# Altium schematic sheet Sheet5.SchDoc: RS485, Relay & Connector
size 420 x 297 mm; SheetNumber: 5; SheetTotal: 5
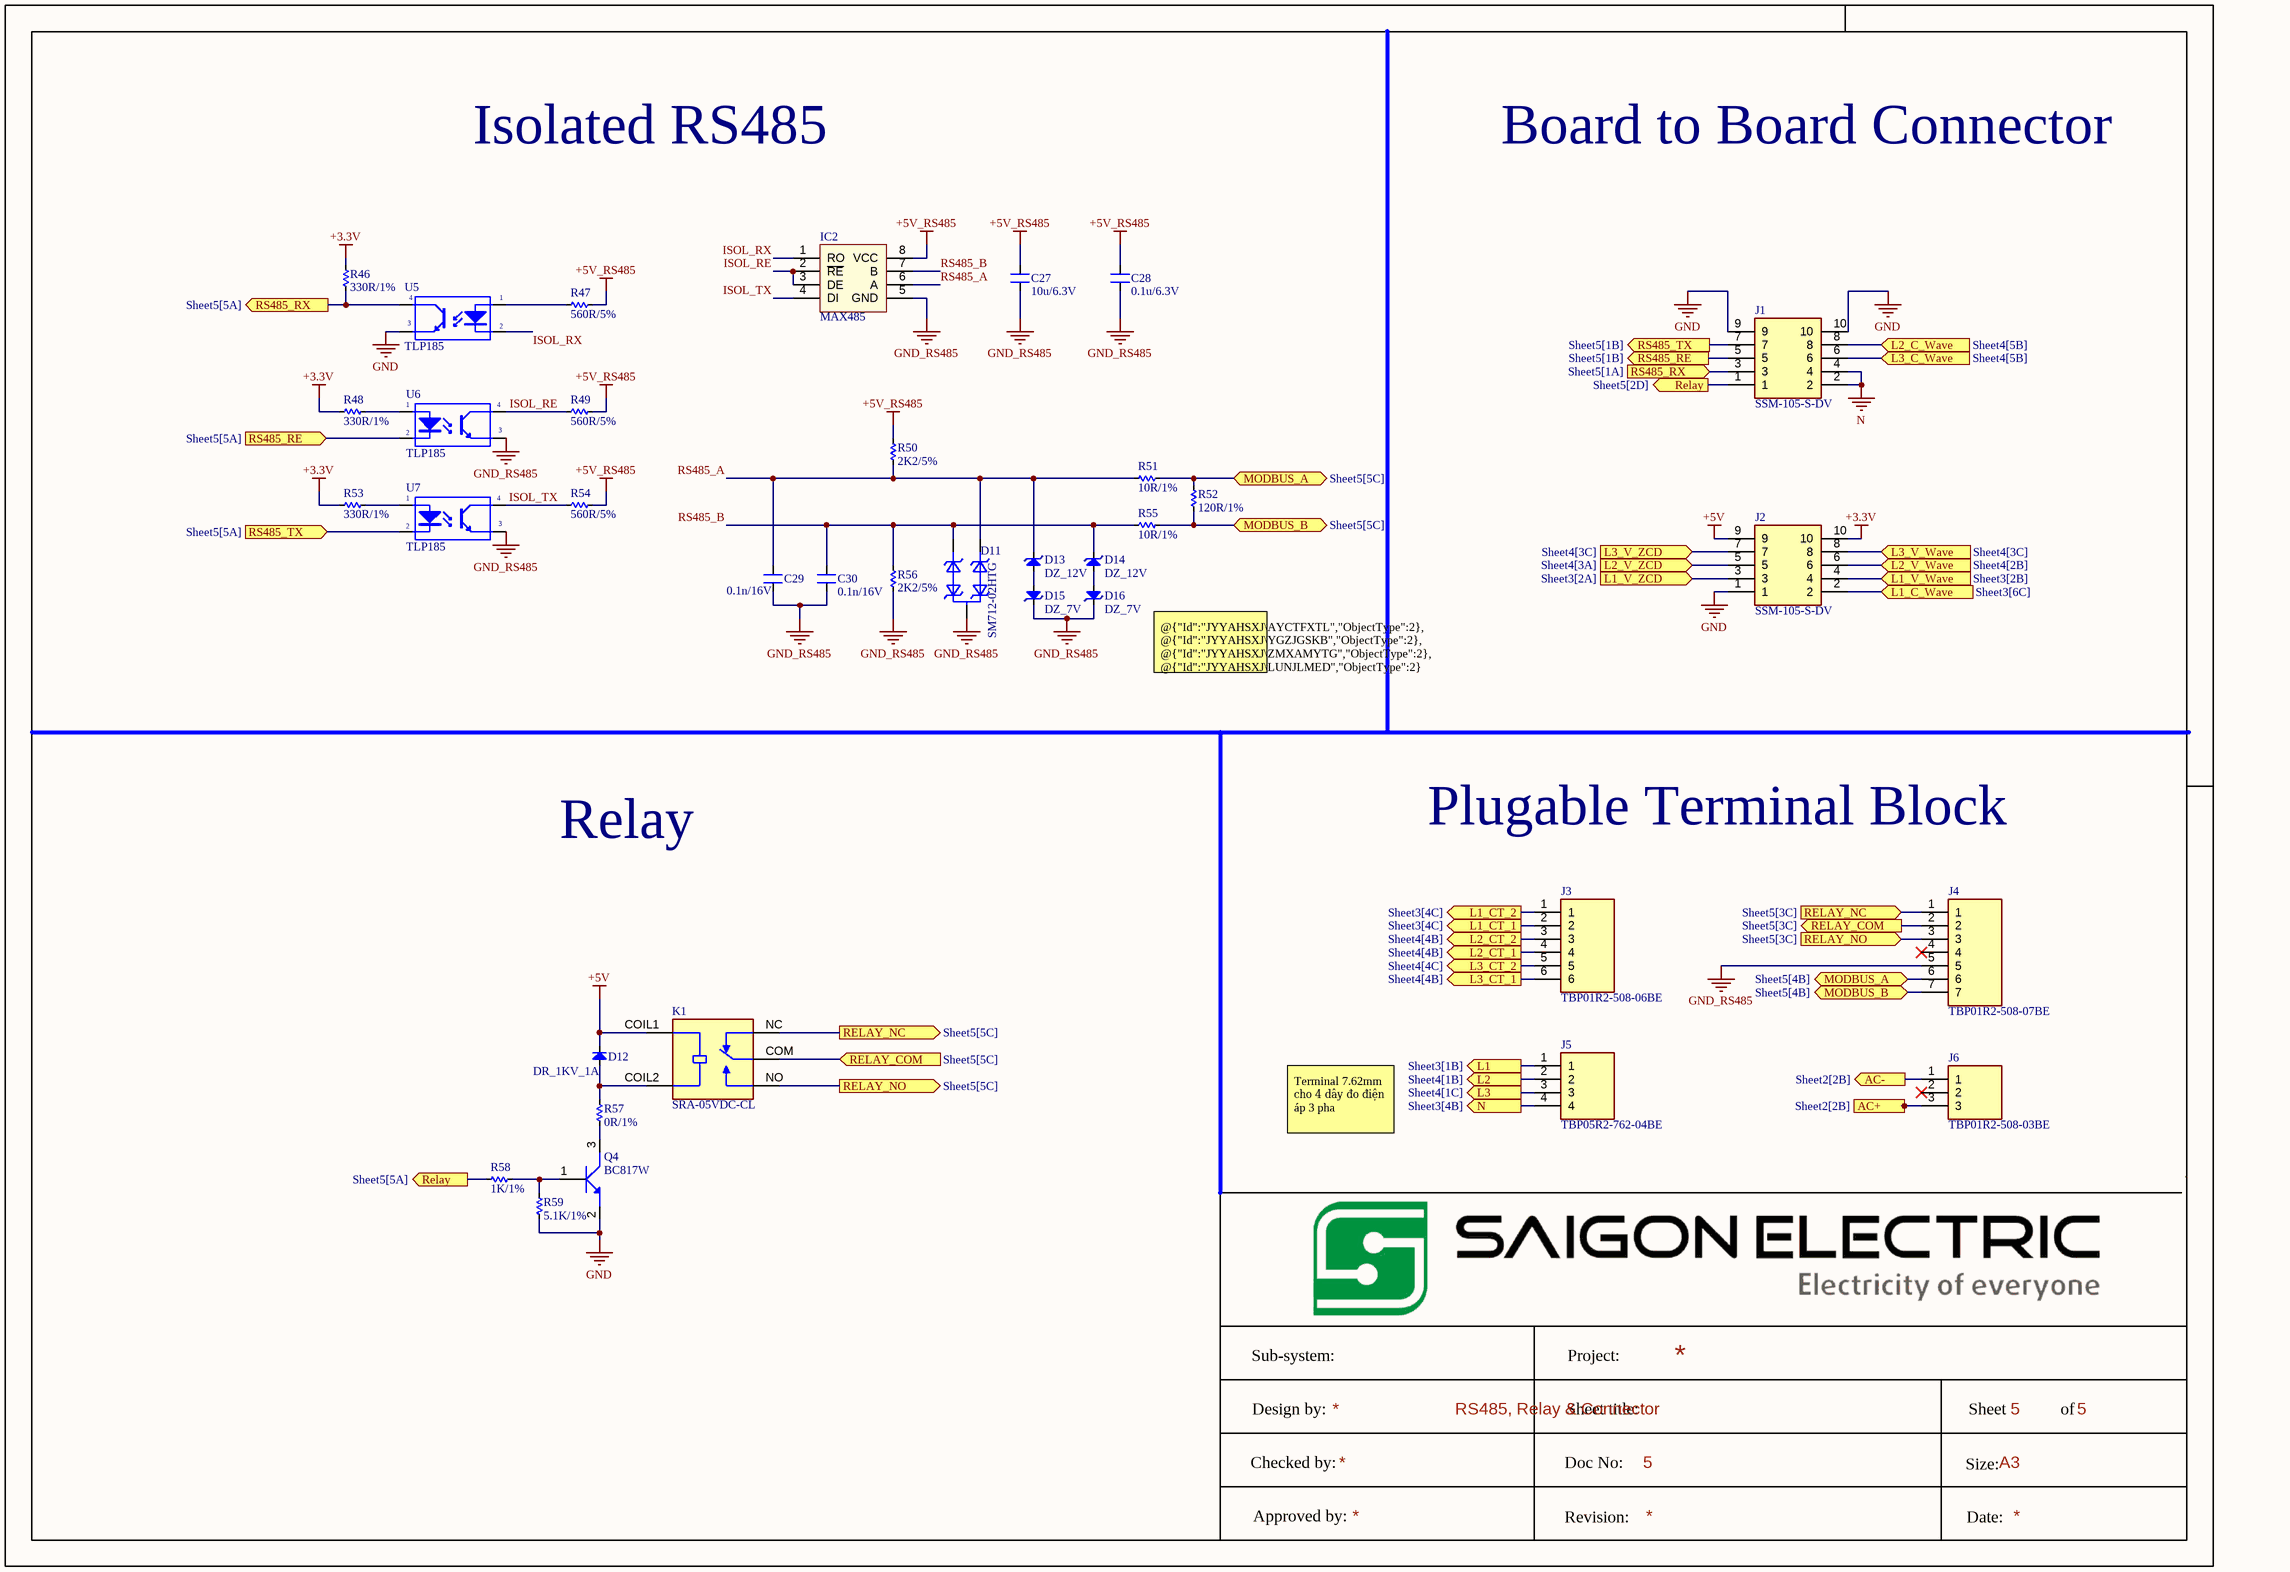
[diagram p0: Sheet5.SchDoc]

## Parts
C27  10u/6.3V  [CAP_C_2012X110]
C28  0.1u/6.3V  [CAP_C_2012X110]
C29  0.1n/16V  [CAP_C_2012X110]
C30  0.1n/16V  [CAP_C_2012X110]
D11  SM712-02HTG  [SOT95P237X112-3N]
D12  DR_1KV_1A  [DIOM5025X26N]
D13  DZ_12V  [LL-34]
D14  DZ_12V  [LL-34]
D15  DZ_7V  [LL-34]
D16  DZ_7V  [LL-34]
IC2  MAX485  [SOIC-8]
J1  SSM-105-S-DV  [SSM-105-XXX-DV-BE]
J2  SSM-105-S-DV  [SSM-105-XXX-DV-BE]
J3  TBP01R2-508-06BE  [CUI_TBP01R2-508-06BE]
J4  TBP01R2-508-07BE  [CUI_TBP01R2-508-07BE]
J5  TBP05R2-762-04BE  [CUI_TBP05R2-762-04BE]
J6  TBP01R2-508-03BE  [CUI_TBP01R2-508-03BE]
K1  SRA-05VDC-CL  [RELAY_SRA-05VDC-CL]
Q4  BC817W  [SOT-323]
R46  330R/1%  [RES_C_2012X65]
R47  560R/5%  [RES_C_2012X65]
R48  330R/1%  [RES_C_2012X65]
R49  560R/5%  [RES_C_2012X65]
R50  2K2/5%  [RES_C_2012X65]
R51  10R/1%  [RES_C_3216X70]
R52  120R/1%  [RES_C_3216X70]
R53  330R/1%  [RES_C_2012X65]
R54  560R/5%  [RES_C_2012X65]
R55  10R/1%  [RES_C_3216X70]
R56  2K2/5%  [RES_C_2012X65]
R57  0R/1%  [RES_C_2012X65]
R58  1K/1%  [RES_C_2012X65]
R59  5.1K/1%  [RES_C_2012X65]
U5  TLP185  [SOP254P700X220-4N]
U6  TLP185  [SOP254P700X220-4N]
U7  TLP185  [SOP254P700X220-4N]

## Ports
AC+ (out, see Sheet2[2B]), AC- (out, see Sheet2[2B]), L1 (out, see Sheet3[1B]), L1_C_Wave (in, see Sheet3[6C]), L1_CT_1 (out, see Sheet3[4C]), L1_CT_2 (out, see Sheet3[4C]), L1_V_Wave (in, see Sheet3[2B]), L1_V_ZCD (in, see Sheet3[2A]), L2 (out, see Sheet4[1B]), L2_C_Wave (in, see Sheet4[5B]), L2_CT_1 (out, see Sheet4[4B]), L2_CT_2 (out, see Sheet4[4B]), L2_V_Wave (in, see Sheet4[2B]), L2_V_ZCD (in, see Sheet4[3A]), L3 (out, see Sheet4[1C]), L3_C_Wave (in, see Sheet4[5B]), L3_CT_1 (out, see Sheet4[4B]), L3_CT_2 (out, see Sheet4[4C]), L3_V_Wave (in, see Sheet4[3C]), L3_V_ZCD (in, see Sheet4[3C]), MODBUS_A (bidir, see Sheet5[4B]), MODBUS_A (bidir, see Sheet5[5C]), MODBUS_B (bidir, see Sheet5[4B]), MODBUS_B (bidir, see Sheet5[5C]), N (out, see Sheet3[4B]), Relay (out, see Sheet5[2D]), Relay (out, see Sheet5[5A]), RELAY_COM (in, see Sheet5[5C]), RELAY_COM (out, see Sheet5[3C]), RELAY_NC (in, see Sheet5[3C]), RELAY_NC (out, see Sheet5[5C]), RELAY_NO (in, see Sheet5[3C]), RELAY_NO (out, see Sheet5[5C]), RS485_RE (in, see Sheet5[5A]), RS485_RE (out, see Sheet5[1B]), RS485_RX (in, see Sheet5[1A]), RS485_RX (out, see Sheet5[5A]), RS485_TX (in, see Sheet5[5A]), RS485_TX (out, see Sheet5[1B])

## Nets
+3.3V: J2.10 R46.1 R48.1 R53.1
+5V: D12.2(K) J2.9 K1.COIL1
+5V_RS485: C27.2 C28.2 IC2.8(VCC) R47.2 R49.2 R50.2 R54.2
GND: J1.9 J1.10 J2.1 Q4.2(E) R59.1 U5.3(E)
GND_RS485: C27.1 C28.1 C29.1 C30.1 D11.3 D15.1(K) D16.1(K) IC2.5(GND) J4.5 R56.1 U6.3(E) U7.3(E)
N: J1.2 J1.4
AC+: J6.3 ; port AC+
AC-: J6.1 ; port AC-
ISOL_RE: IC2.2(~{RE}) IC2.3(DE) R49.1 U6.4(C)
ISOL_RX: IC2.1(RO) U5.2(K)
ISOL_TX: IC2.4(DI) R54.1 U7.4(C)
L1: J5.1 ; port L1
L1_C_Wave: J2.2 ; port L1_C_Wave
L1_CT_1: J3.2 ; port L1_CT_1
L1_CT_2: J3.1 ; port L1_CT_2
L1_V_Wave: J2.4 ; port L1_V_Wave
L1_V_ZCD: J2.3 ; port L1_V_ZCD
L2: J5.2 ; port L2
L2_C_Wave: J1.8 ; port L2_C_Wave
L2_CT_1: J3.4 ; port L2_CT_1
L2_CT_2: J3.3 ; port L2_CT_2
L2_V_Wave: J2.6 ; port L2_V_Wave
L2_V_ZCD: J2.5 ; port L2_V_ZCD
L3: J5.3 ; port L3
L3_C_Wave: J1.6 ; port L3_C_Wave
L3_CT_1: J3.6 ; port L3_CT_1
L3_CT_2: J3.5 ; port L3_CT_2
L3_V_Wave: J2.8 ; port L3_V_Wave
L3_V_ZCD: J2.7 ; port L3_V_ZCD
MODBUS_A: J4.6 R51.2 R52.2 ; port MODBUS_A
MODBUS_B: J4.7 R52.1 R55.2 ; port MODBUS_B
N: J5.4 ; port N  [a separate net that carries the same name]
Relay: J1.1 R58.1 ; port Relay
RELAY_COM: J4.2 K1.COM ; port RELAY_COM
RELAY_NC: J4.1 K1.NC ; port RELAY_NC
RELAY_NO: J4.3 K1.NO ; port RELAY_NO
RS485_A: C29.2 D11.1 D13.1(K) IC2.6(A) R50.1 R51.1
RS485_B: C30.2 D11.2 D14.1(K) IC2.7(B) R55.1 R56.2
RS485_RE: J1.5 U6.2(K) ; port RS485_RE
RS485_RX: J1.3 R46.2 U5.4(C) ; port RS485_RX
RS485_TX: J1.7 U7.2(K) ; port RS485_TX
NetD12_1: D12.1(A) K1.COIL2 R57.2
NetD13_2: D13.2(A) D15.2(A)
NetD14_2: D14.2(A) D16.2(A)
NetQ4_1: Q4.1(B) R58.2 R59.2
NetQ4_3: Q4.3(C) R57.1
NetR47_1: R47.1 U5.1(A)
NetR48_2: R48.2 U6.1(A)
NetR53_2: R53.2 U7.1(A)

Not connected (* = marked no-connect by the designer): J4 4*; J6 2*

## Notes on the sheet
- Isolated RS485
- Board to Board Connector
- @{"Id":"JYYAHSXJ\AYCTFXTL","ObjectType":2}, @{"Id":"JYYAHSXJ\YGZJGSKB","ObjectType":2}, @{"Id":"JYYAHSXJ\ZMXAMYTG","ObjectType":2}, @{"Id":"JYYAHSXJ\LUNJLMED","ObjectType":2} placeholder LL-34 zener
- Relay
- Plugable Terminal Block
- Terminal 7.62mm cho 4 dây đo điện áp 3 pha
- Sub-system:
- Project:
- Design by:
- Sheet title:
- Sheet
- of
- Checked by:
- Approved by:
- Doc No:
- Revision:
- Size:
- Date:
- A3

## Library data of the parts
C27-C30 = CAP_SMD
D11 = SM712-02HTG: TVS Diode, SM712 Series, 31V Clamp, 600W Peak Pulse, Surface Mount, SOT23-3 | Littelfuse SM712-02HTG; MF: Littelfuse Inc.; SnapEDA_Link: https://www.snapeda.com/parts/SM712-02HTG/Littelfuse/view-part/?ref=snap; Package: SOT-23 Littelfuse Inc.; Value: *; MP: SM712-02HTG; Check_prices: https://www.snapeda.com/parts/SM712-02HTG/Littelfuse/view-part/?ref=eda
D12 = Diode: Default Diode; Code - JEDEC: DO-214-AB; Value: 1N5007; Published: 8-Jun-2000; Revision: July-2002: Re-released for DXP Platform.; Publisher: Altium Limited
D13-D16 = DIODE Zener: Zenner
IC2 = MAX485: RS232 - RS485 (Same sn75176)
J1 J2 = SSM-105-S-DV: Connector; Manufacturer_Name: SAMTEC; Datasheet Link: https://mm.digikey.com/Volume0/opasdata/d220001/medias/docus/6129/ssm-1xx-xxx-dv-xx-xx-xxx-x-xx-mkt.pdf; Manufacturer_Part_Number: SSM-105-S-DV; Mouser Part Number: 200-SSM105SDV; Mouser Price/Stock: https://www.mouser.co.uk/ProductDetail/Samtec/SSM-105-S-DV?qs=XtX6y9BSeMiNY1vJI%2FFCQQ%3D%3D; Arrow Part Number: SSM-105-S-DV; Arrow Price/Stock: https://www.arrow.com/en/products/ssm-105-s-dv/samtec
J3 = TBP01R2-508-06BE: 2~24 Ð¿Ð¾Ð»ÑŽÑÐ°, Ð¿Ð¾Ð´ÐºÐ»ÑŽÑ‡Ð°ÐµÐ¼Ñ‹Ð¹, Ð²ÐµÑ€Ñ‚Ð¸ÐºÐ°Ð»ÑŒÐ½Ñ‹Ð¹, ÑˆÐ°Ð³ 5,08, ÐºÐ»ÐµÐ¼Ð¼Ð½Ñ‹Ð¹ Ð±Ð»Ð¾Ðº; MF: Same Sky; SnapEDA_Link: https://www.snapeda.com/parts/TBP01R2-508-06BE/Same+Sky/view-part/?ref=snap; Package: None; Value: *; MP: TBP01R2-508-06BE; Check_prices: https://www.snapeda.com/parts/TBP01R2-508-06BE/Same+Sky/view-part/?ref=eda
J4 = TBP01R2-508-07BE: 2~24 Poles, Pluggable, Receptacle, Vertical, 5.08 Pitch, Terminal Block Connector; MF: Same Sky; SnapEDA_Link: https://www.snapeda.com/parts/TBP01R2-508-07BE/Same+Sky/view-part/?ref=snap; Package: None; Value: *; MP: TBP01R2-508-07BE; Check_prices: https://www.snapeda.com/parts/TBP01R2-508-07BE/Same+Sky/view-part/?ref=eda
J5 = TBP05R2-762-04BE: 2~24 Poles, Pluggable, Receptacle, Vertical, 7.62 Pitch, Terminal Block Connector; MF: Same Sky; SnapEDA_Link: https://www.snapeda.com/parts/TBP05R2-762-04BE/Same+Sky/view-part/?ref=snap; Package: None; Value: *; MP: TBP05R2-762-04BE; Check_prices: https://www.snapeda.com/parts/TBP05R2-762-04BE/Same+Sky/view-part/?ref=eda; LCSC Part #: *
J6 = TBP01R2-508-03BE: 2~24 Poles, Pluggable, Receptacle, Vertical, 5.08 Pitch, Terminal Block Connector; MF: Same Sky; SnapEDA_Link: https://www.snapeda.com/parts/TBP01R2-508-03BE/Same+Sky/view-part/?ref=snap; Package: None; Value: *; MP: TBP01R2-508-03BE; Check_prices: https://www.snapeda.com/parts/TBP01R2-508-03BE/Same+Sky/view-part/?ref=eda
K1 = SRA-05VDC-CL: MF: Songle Relay; SnapEDA_Link: https://www.snapeda.com/parts/SRA-05VDC-CL/Songle+Relay/view-part/?ref=snap; Package: Package; Value: *; MP: SRA-05VDC-CL; Check_prices: https://www.snapeda.com/parts/SRA-05VDC-CL/Songle+Relay/view-part/?ref=eda
Q4 = BJT_NPN: LCSC Part #: *
R46-R59 = Res-SMD: Resistor; Manufacturer: Generic Components; Class: Passive; Published: 08/06/2000; Publisher: Altium Hobart Technology Centre
U5-U7 = TLP185: Single Opto; Value: PC817